# Altium project Pmodkypd.PrjPCB
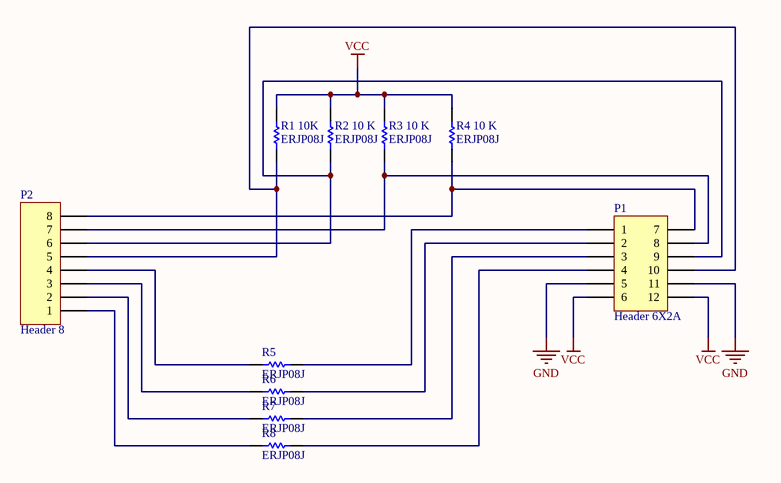
[diagram p0: Pmodkypd.SchDoc]
1 sheet, 10 parts. Net scope: global (net labels, ports and power ports of the same name join across sheets).
Board file: Pmodkypd.PcbDoc

## Sheet Pmodkypd.SchDoc
size A4

### Parts
P1  Header 6X2A  [HDR2X6_CEN]
P2  Header 8  [HDR1X8]
R1_10K  ERJP08J  [8-1206]
R2_10_K  ERJP08J  [8-1206]
R3_10_K  ERJP08J  [8-1206]
R4_10_K  ERJP08J  [8-1206]
R5  ERJP08J  [8-1206]
R6  ERJP08J  [8-1206]
R7  ERJP08J  [8-1206]
R8  ERJP08J  [8-1206]

### Nets
GND: P1.5 P1.11
VCC: P1.6 P1.12 R1_10K.2 R2_10_K.2 R3_10_K.2 R4_10_K.2
NetP1_1: P1.1 R5.1
NetP1_2: P1.2 R6.1
NetP1_3: P1.3 R7.1
NetP1_4: P1.4 R8.1
NetP1_7: P1.7 P2.8 R4_10_K.1
NetP1_8: P1.8 P2.7 R3_10_K.1
NetP1_9: P1.9 P2.6 R2_10_K.1
NetP1_10: P1.10 P2.5 R1_10K.1
NetP2_1: P2.1 R8.2
NetP2_2: P2.2 R7.2
NetP2_3: P2.3 R6.2
NetP2_4: P2.4 R5.2

### Library data of the parts
P1 = Header 6X2A: Header, 6-Pin, Dual row; LatestRevisionDate: 17-Jul-2002; LatestRevisionNote: Re-released for DXP Platform.; Publisher: Altium Limited
P2 = Header 8: Header, 8-Pin; LatestRevisionDate: 17-Jul-2002; LatestRevisionNote: Re-released for DXP Platform.; Publisher: Altium Limited
R1_10K R2_10_K R3_10_K R4_10_K R5-R8 = ERJP08J: Anti-Surge Thick Film Chip Resistor, 10 Ohm to 1M Ohm Range, 5% Tolerance, 1206 Size, 0.25 W; Note: If flow soldering, adjust pad width of PCB Footprint to 0.7 - 0.8 times the width of the resistor.; Published: 17-Dec-2003; LatestRevisionDate: 19-Mar-2004; LatestRevisionNote: Silkscreen size reduced.; PackageDocument: Mar-2003; PackageReference: 8-1206; Publisher: Altium Limited; Code_IPC: 3216 [1206]; ComponentLink1Description: Manufacturer Link; ComponentLink1URL: http://www.panasonic.com/industrial/components/resistive_products.htm; ComponentLink2Description: Datasheet; ComponentLink2URL: http://www.panasonic.com/industrial/components/pdf/AOA0000CE4.pdf